# EAGLE schematic ModuleCarrier-ISM4343-WBM-L44-C-v1.0.0 (EAGLE 7.7.0)

## Sheet 1 of 2
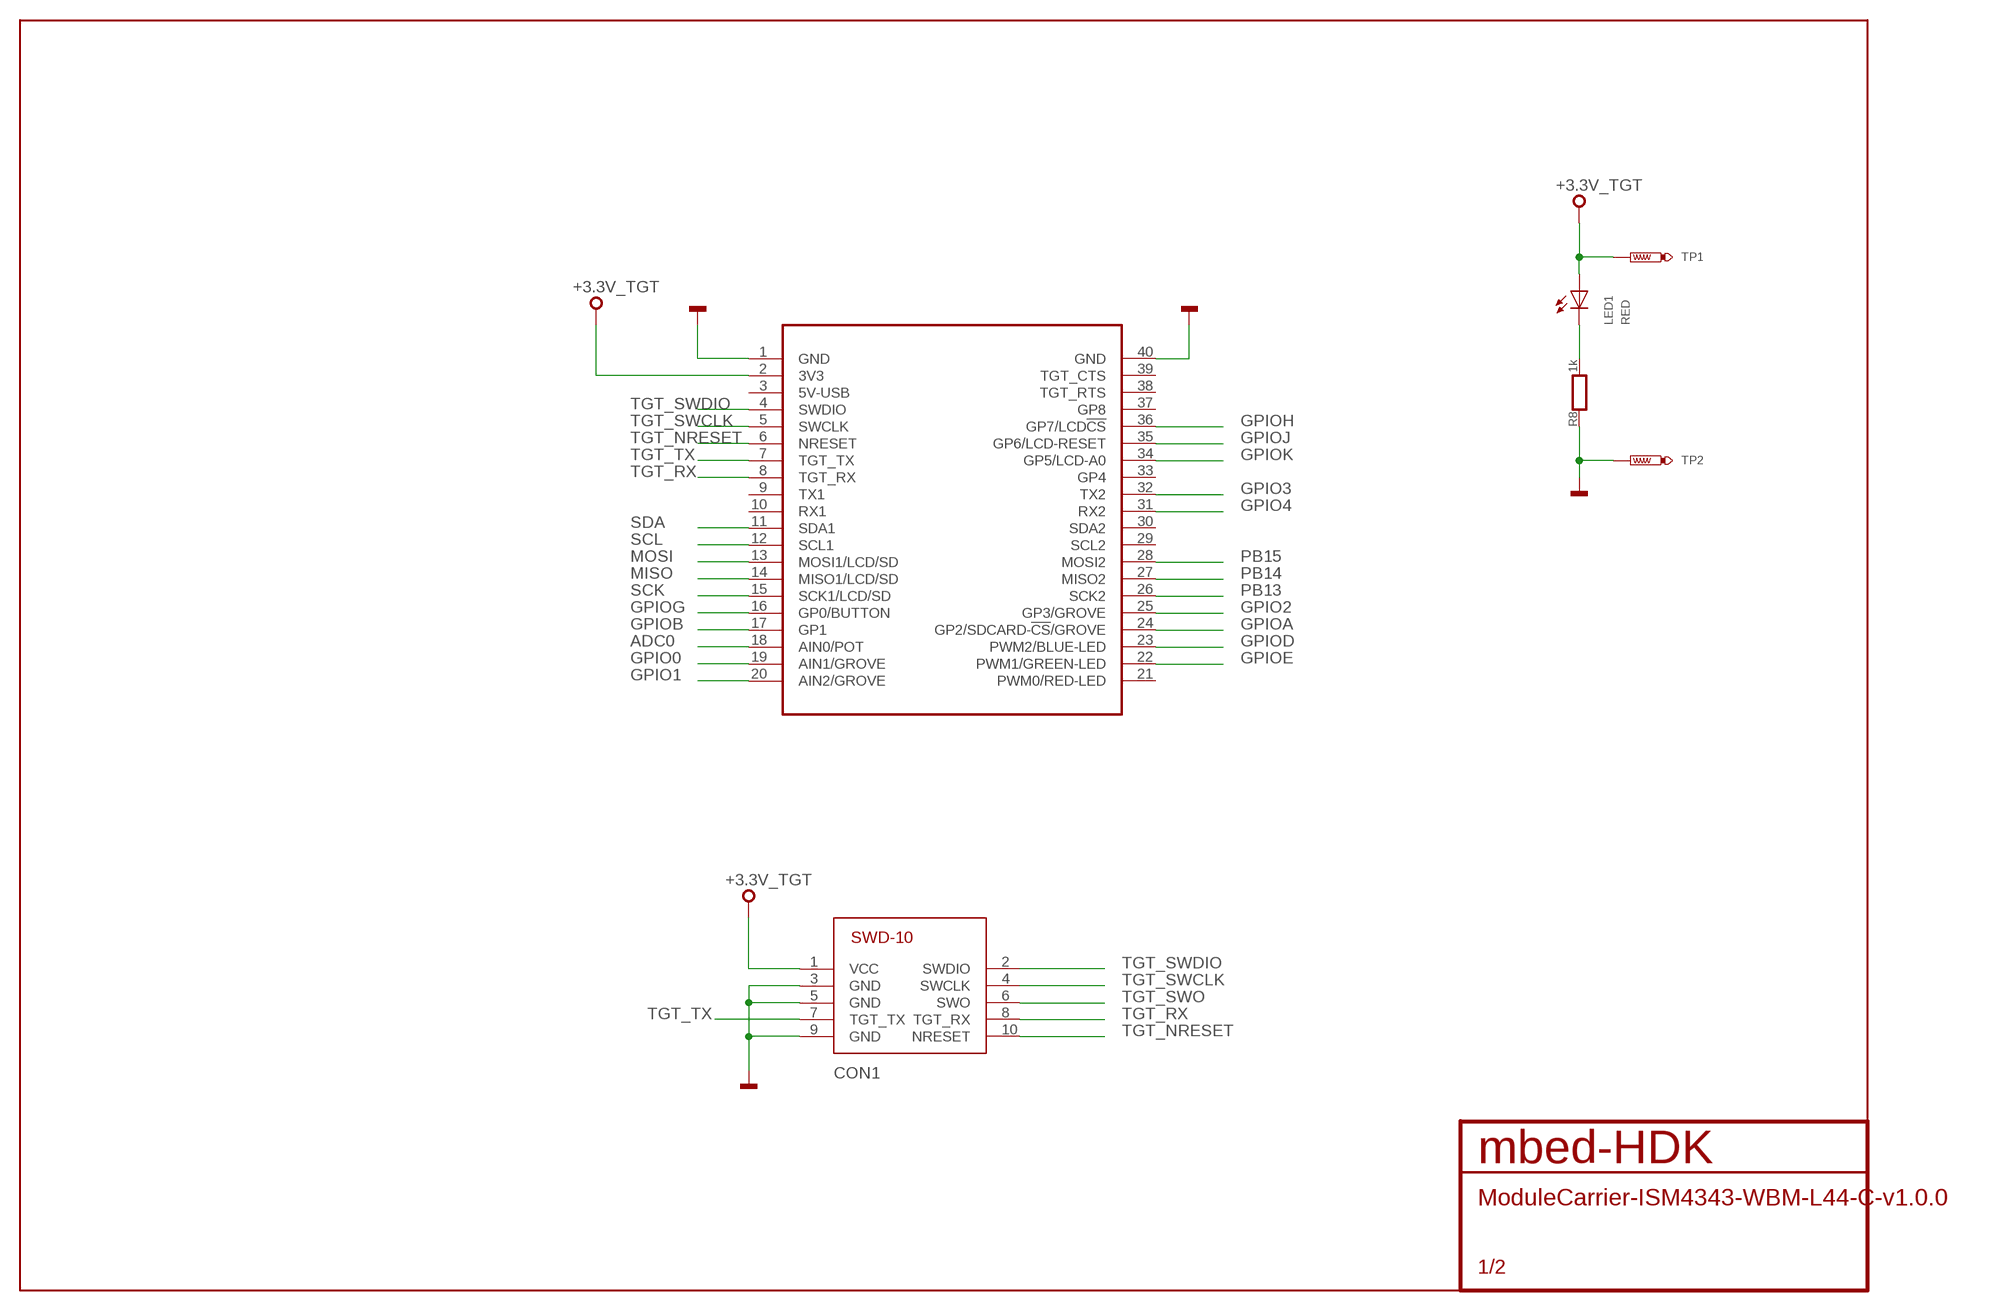
[diagram p0: schematic, sheet 1]

### Parts
CON1  SWD-10/TC2050_SMD  [FTSH-105-02]
LED1  RED  SMD_LED0603  [CHIPLED_0603]
MOD2  MODULE_DAUGHTER  [MODULE_DAUGHTER]
R8  1k  RESISTOR0603  [0603]
TP1  TEST-POINT-50R-PTH  [TP50-PTH]
TP2  TEST-POINT-50R-PTH  [TP50-PTH]

### Nets
+3.3V_TGT: CON1.1(VCC) LED1.A MOD2.2(3V3) TP1.TP ; also sheet 2
ADC0: MOD2.18(AIN0/POT) ; also sheet 2
GND: CON1.3(GND) CON1.5(GND) CON1.9(GND) MOD2.1(GND) MOD2.40(GND) R8.1 TP2.TP ; also sheet 2
GPIO0: MOD2.19(AIN1/GROVE) ; also sheet 2
GPIO1: MOD2.20(AIN2/GROVE) ; also sheet 2
GPIO2: MOD2.25(GP3/GROVE) ; also sheet 2
GPIO3: MOD2.32(TX2) ; also sheet 2
GPIO4: MOD2.31(RX2) ; also sheet 2
GPIOA: MOD2.24(GP2/SDCARD-!CS!/GROVE) ; also sheet 2
GPIOB: MOD2.17(GP1) ; also sheet 2
GPIOD: MOD2.23(PWM2/BLUE-LED) ; also sheet 2
GPIOE: MOD2.22(PWM1/GREEN-LED) ; also sheet 2
GPIOG: MOD2.16(GP0/BUTTON) ; also sheet 2
GPIOH: MOD2.36(GP7/LCD!CS) ; also sheet 2
GPIOJ: MOD2.35(GP6/LCD-RESET) ; also sheet 2
GPIOK: MOD2.34(GP5/LCD-A0) ; also sheet 2
MISO: MOD2.14(MISO1/LCD/SD) ; also sheet 2
MOSI: MOD2.13(MOSI1/LCD/SD) ; also sheet 2
PA_1: LED1.C R8.2
PB13: MOD2.26(SCK2) ; also sheet 2
PB14: MOD2.27(MISO2) ; also sheet 2
PB15: MOD2.28(MOSI2) ; also sheet 2
SCK: MOD2.15(SCK1/LCD/SD) ; also sheet 2
SCL: MOD2.12(SCL1) ; also sheet 2
SDA: MOD2.11(SDA1) ; also sheet 2
TGT_NRESET: CON1.10(NRESET) MOD2.6(NRESET) ; also sheet 2
TGT_RX: CON1.8(TGT_RX) MOD2.8(TGT_RX) ; also sheet 2
TGT_SWCLK: CON1.4(SWCLK) MOD2.5(SWCLK) ; also sheet 2
TGT_SWDIO: CON1.2(SWDIO) MOD2.4(SWDIO) ; also sheet 2
TGT_SWO: CON1.6(SWO) ; also sheet 2
TGT_TX: CON1.7(TGT_TX) MOD2.7(TGT_TX) ; also sheet 2
Unconnected: MOD2.3(5V-USB) MOD2.9(TX1) MOD2.10(RX1) MOD2.21(PWM0/RED-LED) MOD2.29(SCL2) MOD2.30(SDA2) MOD2.33(GP4) MOD2.37(GP8) MOD2.38(TGT_RTS) MOD2.39(TGT_CTS)

## Sheet 2 of 2
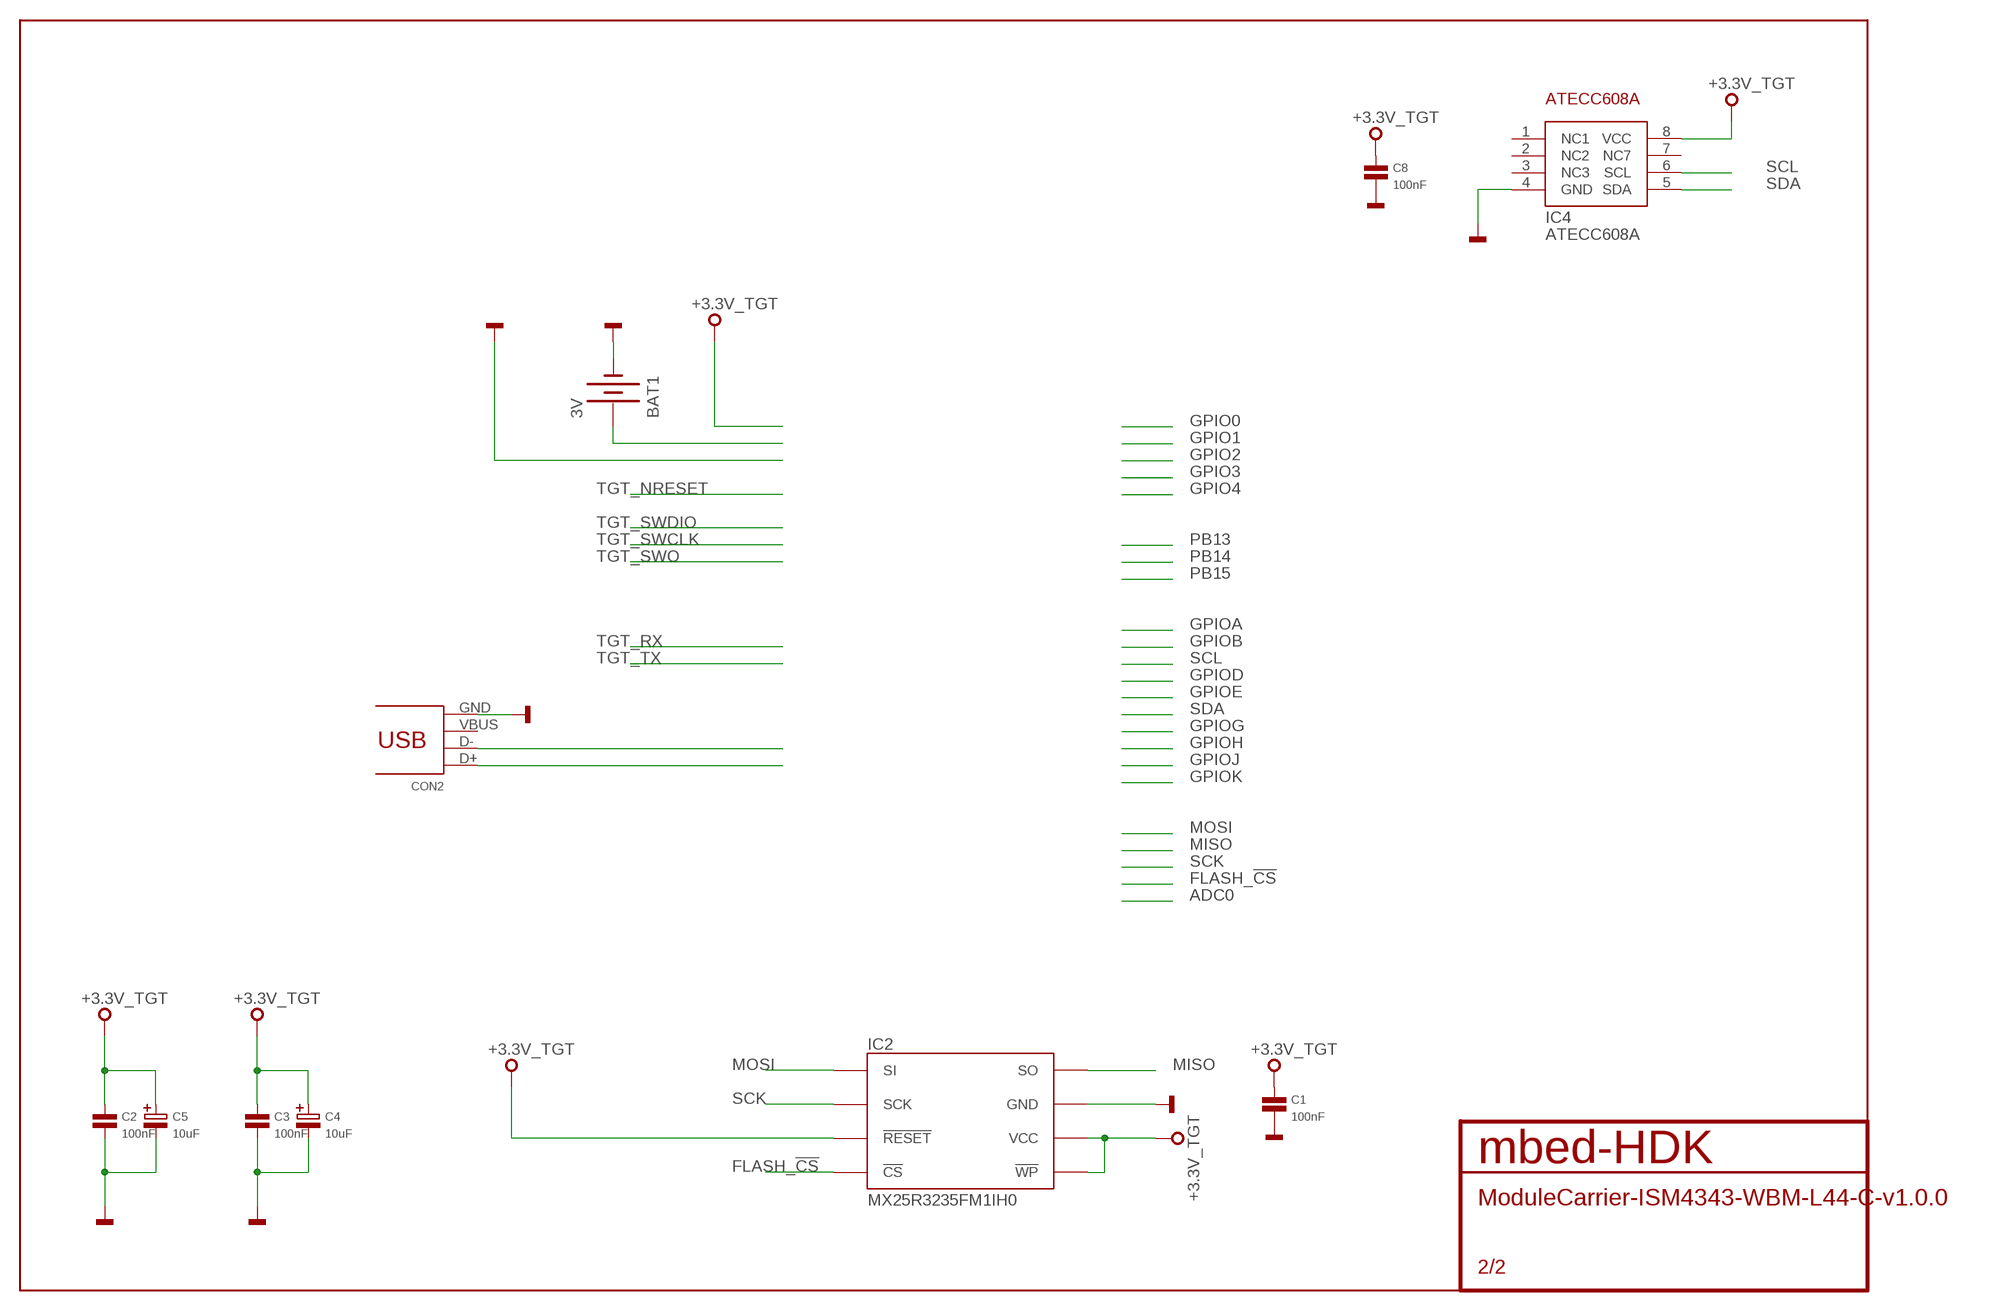
[diagram p1: schematic, sheet 2]

### Parts
BAT1  3V  BATTERY12MM  [BATTCON_12MM]
C1  100nF  CAPACITOR0603  [0603]
C2  100nF  CAPACITOR0603  [0603]
C3  100nF  CAPACITOR0603  [0603]
C4  10uF  CAPACITOR-POLARISEDB  [SMC_B]
C5  10uF  CAPACITOR-POLARISEDB  [SMC_B]
C8  100nF  CAPACITOR0603  [0603]
CON2  10033526-N3212MLF  [USB-MINI-B-H]
IC2  MX25R3235FM1IH0  [SO8]
IC4  ATECC608A  [SO8]

### Nets
+3.3V_TGT: C1.1 C2.1 C3.1 C4.+ C5.+ C8.1 IC2.3(!WP) IC2.7(!RESET) IC2.8(VCC) IC4.8(VCC) ; also sheet 1
FLASH_!CS: IC2.1(!CS)
GND: BAT1.GND(-) C1.2 C2.2 C3.2 C4.- C5.- C8.2 CON2.GND IC2.4(GND) IC4.4(GND) ; also sheet 1
MISO: IC2.2(SO) ; also sheet 1
MOSI: IC2.5(SI) ; also sheet 1
N$1: CON2.D+
N$2: CON2.D-
N$3: BAT1.PWR@1(+)
SCK: IC2.6(SCK) ; also sheet 1
SCL: IC4.6(SCL) ; also sheet 1
SDA: IC4.5(SDA) ; also sheet 1
Unconnected: CON2.VBUS IC4.1(NC1) IC4.2(NC2) IC4.3(NC3) IC4.7(NC7)

## Library data of the parts
BAT1 = SparkFun-Electromechanical:BATTERY: Battery Holders Various common sizes : AA, AAA, 18650 (PRT-12895), 20mm coin cell and 12mm coin cell. 20MM_4LEGS, BATT-10373; PROD_ID: BATT-08044
C1-C3 C8 = mbed-HDK-RLC:CAPACITOR: Capacitor
C4 C5 = mbed-HDK-RLC:CAPACITOR-POLARISED: Polarised capacitor; MF: Kemet; MFN: T491B106K020AT; OC-DIGIKEY: 399-8298-1-ND; OC-MOUSER: 80-T491B106K020; OC-NEWARK: 57K1740
CON1 = mbed-HDK-Connector:SWD-10/TC2050: 1mm pitch 10-Pin Cortex Programming Header with optional TC2050 footprint solderless interchangeable
CON2 = mbed-HDK-Connector:10033526-N3212MLF: USB Receptacle Horizontal Mini Type B; MF: Amphenol FCI; MFN: 10033526-N3212MLF; OC-DIGIKEY: 609-4701-1-ND; OC-MOUSER: 649-10033526N3212MLF; OC-NEWARK: 14N2224
IC2 = blackbriar:MX25R3235FM1IH0: Serial Flash 32 Mb 80 Mhz; MF: Macronix; MFN: MX25R3235FM2IH0; OC-DIGIKEY: 1092-1174-ND
IC4 = blackbriar:ATECC608A
LED1 = mbed-HDK-Optical:SMD_LED: LED SMD, Colour Red; MF: Wurth Electronics Inc; MFN: 150060RS75000; OC-DIGIKEY: 732-4978-1-ND; OC-MOUSER: 710-150060RS75000; OC-NEWARK: 2322071
MOD2 = blackbriar:MODULE_DAUGHTER
R8 = mbed-HDK-RLC:RESISTOR: Resistor
TP1 TP2 = mbed-HDK:TEST-POINT